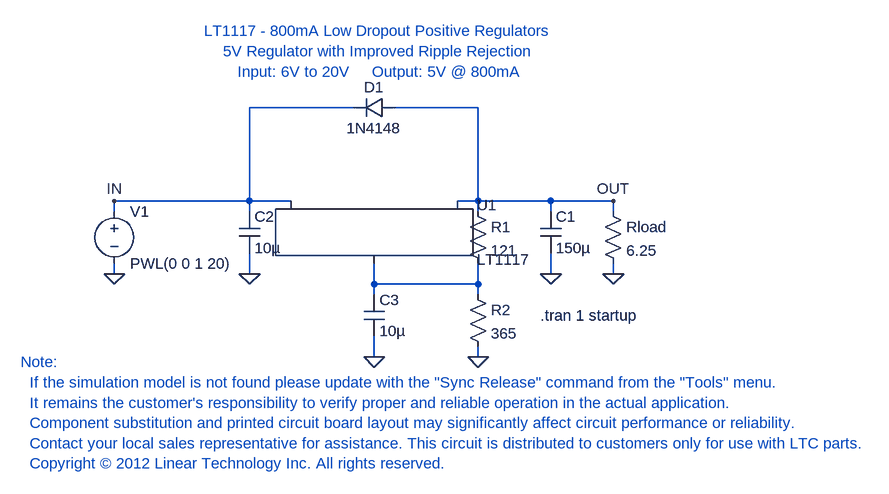
[diagram p0: schematic lt1117_ta10.asc]
lt1117_ta10.asc, the LTspice schematic file:
Version 4
SHEET 1 1320 684
WIRE 176 16 16 16
WIRE 368 16 240 16
WIRE 16 160 16 16
WIRE 16 160 -192 160
WIRE 80 160 16 160
WIRE 368 160 368 16
WIRE 368 160 336 160
WIRE 480 160 368 160
WIRE 576 160 480 160
WIRE -192 176 -192 160
WIRE 16 176 16 160
WIRE 368 176 368 160
WIRE 480 176 480 160
WIRE 576 176 576 160
WIRE -192 272 -192 256
WIRE 16 272 16 240
WIRE 480 272 480 240
WIRE 576 272 576 256
WIRE 208 288 208 256
WIRE 368 288 368 256
WIRE 368 288 208 288
WIRE 208 304 208 288
WIRE 368 304 368 288
WIRE 208 400 208 368
WIRE 368 400 368 384
FLAG 16 272 0
FLAG -192 272 0
FLAG -192 160 IN
FLAG 368 400 0
FLAG 576 272 0
FLAG 480 272 0
FLAG 576 160 OUT
FLAG 208 400 0
SYMBOL PowerProducts\\LT1117 208 160 R0
SYMATTR InstName U1
SYMBOL res 352 160 R0
SYMATTR InstName R1
SYMATTR Value 121
SYMBOL res 352 288 R0
SYMATTR InstName R2
SYMATTR Value 365
SYMBOL cap 464 176 R0
SYMATTR InstName C1
SYMATTR Value 150µ
SYMATTR SpiceLine Rser=10m
SYMBOL cap 0 176 R0
SYMATTR InstName C2
SYMATTR Value 10µ
SYMBOL voltage -192 160 R0
WINDOW 123 0 0 Left 2
WINDOW 39 0 0 Left 2
SYMATTR InstName V1
SYMATTR Value PWL(0 0 1 20)
SYMBOL res 560 160 R0
SYMATTR InstName Rload
SYMATTR Value 6.25
SYMBOL cap 192 304 R0
SYMATTR InstName C3
SYMATTR Value 10µ
SYMBOL diode 240 0 R90
WINDOW 0 0 32 VBottom 2
WINDOW 3 32 32 VTop 2
SYMATTR InstName D1
SYMATTR Value 1N4148
TEXT 464 336 Left 2 !.tran 1 startup
TEXT 216 -24 Bottom 2 ;LT1117 - 800mA Low Dropout Positive Regulators\n5V Regulator with Improved Ripple Rejection\nInput: 6V to 20V     Output: 5V @ 800mA
TEXT -336 408 Left 2 ;Note:\n  If the simulation model is not found please update with the "Sync Release" command from the "Tools" menu.\n  It remains the customer's responsibility to verify proper and reliable operation in the actual application.\n  Component substitution and printed circuit board layout may significantly affect circuit performance or reliability.\n  Contact your local sales representative for assistance. This circuit is distributed to customers only for use with LTC parts.\n  Copyright © 2012 Linear Technology Inc. All rights reserved.

The netlist it stands for:
* lt1117_ta10.asc
XU1 N001 OUT IN LT1117
R1 OUT N001 121
R2 N001 0 365
C1 OUT 0 150µ Rser=10m
C2 IN 0 10µ
V1 IN 0 PWL(0 0 1 20)
Rload OUT 0 6.25
C3 N001 0 10µ
D1 OUT IN 1N4148
.model D D
.lib standard.dio
.tran 1 startup
* LT1117 - 800mA Low Dropout Positive Regulators
* 5V Regulator with Improved Ripple Rejection
* Input: 6V to 20V     Output: 5V @ 800mA
* Note:
*   If the simulation model is not found please update with the "Sync Release" command from the "Tools" menu.
*   It remains the customer's responsibility to verify proper and reliable operation in the actual application.
*   Component substitution and printed circuit board layout may significantly affect circuit performance or reliability.
*   Contact your local sales representative for assistance. This circuit is distributed to customers only for use with LTC parts.
*   Copyright © 2012 Linear Technology Inc. All rights reserved.
.lib LT1117.lib
.backanno
.end